# Altium project Display_Control_UV.PrjPcb
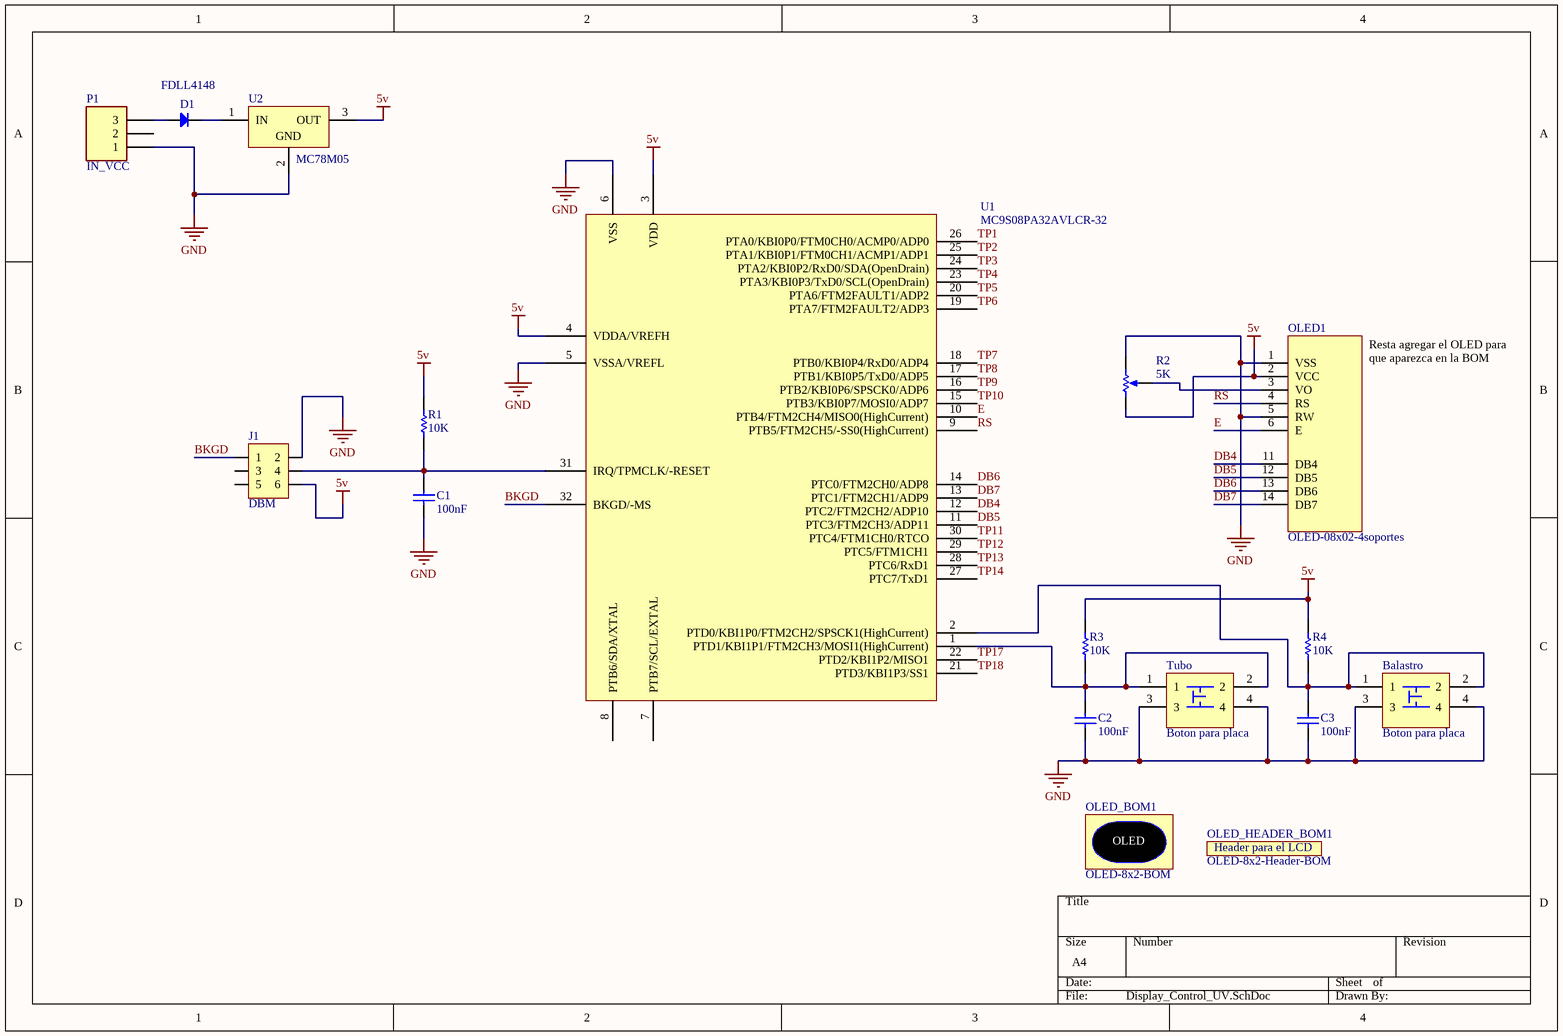
[diagram p0: Display_Control_UV.SchDoc]
1 sheet, 17 parts. Net scope: global (net labels, ports and power ports of the same name join across sheets).
Board file: Display_Control_UV.PcbDoc

## Sheet Display_Control_UV.SchDoc
size A4

### Parts
Balastro  Boton para placa  [TactButton]
C1  100nF  [C_0603]
C2  100nF  [C_0603]
C3  100nF  [C_0603]
D1  FDLL4148  [SOD-80/MLL34]
J1  DBM  [DBM]
OLED1  OLED-08x02-4soportes  [OLED-ZocaloDoble]
OLED_BOM1  OLED-8x2-BOM  [OLED-08x02-4soportes]
OLED_HEADER_BOM1  OLED-8x2-Header-BOM
P1  IN_VCC  [B3B-XH-A_3D]
R1  10K  [R_0603]
R2  5K  [Preset_SMD]
R3  10K  [R_0603]
R4  10K  [R_0603]
Tubo  Boton para placa  [TactButton]
U1  MC9S08PA32AVLCR-32  [QFP7x7]
U2  MC78M05  [TO-252AA_N]

### Nets
5v: J1.6 OLED1.2(VCC) R1.2 R2.1(TOP_CCW) R3.2 R4.2 U1.3(VDD) U1.4(VDDA/VREFH) U2.3(OUT)
GND: Balastro.3 Balastro.4 C1.1 C2.1 C3.1 J1.2 OLED1.1(VSS) OLED1.5(RW) P1.1 R2.3(BOT_CW) Tubo.3 Tubo.4 U1.5(VSSA/VREFL) U1.6(VSS) U2.2(GND)
BKGD: J1.1 U1.32(BKGD/-MS)
DB4: OLED1.11(DB4) U1.12(PTC2/FTM2CH2/ADP10)
DB5: OLED1.12(DB5) U1.11(PTC3/FTM2CH3/ADP11)
DB6: OLED1.13(DB6) U1.14(PTC0/FTM2CH0/ADP8)
DB7: OLED1.14(DB7) U1.13(PTC1/FTM2CH1/ADP9)
E: OLED1.6(E) U1.10(PTB4/FTM2CH4/MISO0(HighCurrent))
RS: OLED1.4(RS) U1.9(PTB5/FTM2CH5/-SS0(HighCurrent))
TP1: U1.26(PTA0/KBI0P0/FTM0CH0/ACMP0/ADP0)
TP2: U1.25(PTA1/KBI0P1/FTM0CH1/ACMP1/ADP1)
TP3: U1.24(PTA2/KBI0P2/RxD0/SDA(OpenDrain))
TP4: U1.23(PTA3/KBI0P3/TxD0/SCL(OpenDrain))
TP5: U1.20(PTA6/FTM2FAULT1/ADP2)
TP6: U1.19(PTA7/FTM2FAULT2/ADP3)
TP7: U1.18(PTB0/KBI0P4/RxD0/ADP4)
TP8: U1.17(PTB1/KBI0P5/TxD0/ADP5)
TP9: U1.16(PTB2/KBI0P6/SPSCK0/ADP6)
TP10: U1.15(PTB3/KBI0P7/MOSI0/ADP7)
TP11: U1.30(PTC4/FTM1CH0/RTCO)
TP12: U1.29(PTC5/FTM1CH1)
TP13: U1.28(PTC6/RxD1)
TP14: U1.27(PTC7/TxD1)
TP17: U1.22(PTD2/KBI1P2/MISO1)
TP18: U1.21(PTD3/KBI1P3/SS1)
NetBalastro_1: Balastro.1 Balastro.2 C3.2 R4.1 U1.2(PTD0/KBI1P0/FTM2CH2/SPSCK1(HighCurrent))
NetC1_2: C1.2 J1.4 R1.1 U1.31(IRQ/TPMCLK/-RESET)
NetC2_2: C2.2 R3.1 Tubo.1 Tubo.2 U1.1(PTD1/KBI1P1/FTM2CH3/MOSI1(HighCurrent))
NetD1_1: D1.1(A) P1.3
NetD1_2: D1.2(K) U2.1(IN)
NetOLED1_3: OLED1.3(VO) R2.2(TAP)

Not connected (* = marked no-connect by the designer): J1 3 5; P1 2; U1 7(PTB7/SCL/EXTAL) 8(PTB6/SDA/XTAL)

### Notes on the sheet
- (in symbol OLED-08x02-4soportes) Resta agregar el OLED para que aparezca en la BOM
- (in symbol OLED-8x2-BOM) OLED
- (in symbol OLED-8x2-Header-BOM) Header para el LCD

### Library data of the parts
Balastro Tubo = TactButton: Ejemplo; Cod.Fabricante: 1825910-6; Fabricante: TE Connectivity ALCOSWITCH Switches; Cod.DigiKey: 450-1650-ND; ComponentLink1Description: Manufacturer Link; ComponentLink1URL: https://www.te.com/commerce/DocumentDelivery/DDEController?Action=srchrtrv&DocNm=1825910&DocType=Customer+Drawing&DocLang=English; ComponentLink2Description: Datasheet; ComponentLink2URL: https://www.te.com/commerce/DocumentDelivery/DDEController?Action=srchrtrv&DocNm=1825910&DocType=Customer+Drawing&DocLang=English; DatasheetVersion: *; DIGIKEYx100: 0.08700; LatestRevisionDate: *; LatestRevisionNote: *; PackageDescription: *; PackageReference: *; PackageVersion: *; Published: 29-sep-00; Publisher: Altium Limited; Value: *
C1-C3 = C_100nF_0603: CAP CER 0.1UF 50V X7R 0603; Note: Footprint corresponds to dimensions for bulk cassette packaging. This case size has tightened tolerances.; Cod.Fabricante: C0603C104M5RACTU; Fabricante: KEMET; Published: 17-Jul-2002; LatestRevisionDate: 19-Mar-2004; LatestRevisionNote: Silkscreen size reduced.; DatasheetDocument: Mar-2001; PackageDocument: Mar-2001; PackageReference: 0603; Publisher: Altium Limited; ComponentLink1Description: Manufacturer Link; ComponentLink1URL: http://www.kemet.com/; ComponentLink2Description: Datasheet; ComponentLink2URL: https://api.kemet.com/component-edge/download/datasheet/C0603C104M5RACTU.pdf; Cod.Digikey: 399-7845-1-ND; Value: 100nF; DIGIKEYx100: 0.01740
D1 = Diode FDLL4148: DIODE GEN PURP 100V 200MA LL34/SOD80/MINI MELF; Fabricante: ON Semiconductor; Published: 8-Jun-2000; LatestRevisionDate: 17-Jul-2002; LatestRevisionNote: Re-released for DXP Platform.; DatasheetDocument: 1998; PackageDocument: Aug-1999; PackageReference: MINI MELF; Publisher: Altium Limited; Code_JEDEC: MINI MELF; ComponentLink1Description: Manufacturer Link; ComponentLink1URL: https://www.fairchildsemi.com; ComponentLink2Description: Datasheet; ComponentLink2URL: https://www.fairchildsemi.com/datasheets/FD/FDLL4148.pdf; Value: FDLL4148; Cod.Digikey: FDLL4148CT-ND; Cod.Fabricante: FDLL4148; DIGIKEYx100: 0.0487
J1 = DBM: CONN HEADER VERT 6POS 2.54MM; Cod.Fabricante: PRPC003DAAN-RC; Fabricante: Sullins Connector Solutions; Cod.DigiKey: S2011EC-03-ND; ComponentLink1Description: Manufacturer Link; ComponentLink1URL: https://drawings-pdf.s3.amazonaws.com/11636.pdf; ComponentLink2Description: Datasheet; ComponentLink2URL: *; DatasheetVersion: *; DIGIKEYx100: 0.12070; LatestRevisionDate: *; LatestRevisionNote: *; PackageDescription: *; PackageReference: *; PackageVersion: *; Published: 29-sep-00; Publisher: Altium Limited; Value: *
OLED1 = OLED-08x02-4soportes: Header para la placa 8x2 OLED Character Display; Cod.Fabricante: PRPC008DAAN-RC; Fabricante: Sullins Connector Solutions; Cod.DigiKey: S2011EC-08-ND; ComponentLink1Description: Manufacturer Link; ComponentLink1URL: https://drawings-pdf.s3.amazonaws.com/11636.pdf; ComponentLink2Description: Datasheet; ComponentLink2URL: https://drawings-pdf.s3.amazonaws.com/11636.pdf; DatasheetVersion: F; DIGIKEYx100: 0.30340; LatestRevisionDate: *; LatestRevisionNote: *; PackageDescription: *; PackageReference: *; PackageVersion: *; Published: 29-sep-00; Publisher: Altium Limited; Value: *
OLED_BOM1 = OLED-8x2-BOM: 8x2 OLED Character Display; Cod.Fabricante: WEH000802A-BPP5N0; Fabricante: Winstar; Cod.DigiKey: -; ComponentLink1Description: Manufacturer Link; ComponentLink1URL: http://www.sycelectronica.com.ar/optoelectronica/WH0802A-XXX-XX.pdf; ComponentLink2Description: Datasheet; ComponentLink2URL: *; DatasheetVersion: *; DIGIKEYx100: -; LatestRevisionDate: *; LatestRevisionNote: *; PackageDescription: *; PackageReference: *; PackageVersion: *; Published: 29-sep-00; Publisher: Altium Limited; Value: *
OLED_HEADER_BOM1 = OLED-8x2-Header-BOM: Header 8x2; Cod.Fabricante: PPPC082LFBN-RC; Fabricante: Sullins Connector Solutions; Cod.DigiKey: S7111-ND; ComponentLink1Description: Manufacturer Link; ComponentLink1URL: https://media.digikey.com/pdf/Data%20Sheets/Sullins%20PDFs/Female_Headers.100_DS.pdf; ComponentLink2Description: Datasheet; ComponentLink2URL: *; DatasheetVersion: *; DIGIKEYx100: 0.78010; LatestRevisionDate: *; LatestRevisionNote: *; PackageDescription: *; PackageReference: *; PackageVersion: *; Published: 29-sep-00; Publisher: Altium Limited; Value: *
P1 = JST_2.5_3: CONN HEADER XH TOP 3POS 2.5MM; Cod.Fabricante: B3B-XH-A(LF)(SN); Fabricante: JST Sales America Inc.; LatestRevisionDate: 17-Jul-2002; LatestRevisionNote: Re-released for DXP Platform.; Publisher: Altium Limited; Cod.Digikey: 455-2248-ND; ComponentLink2Description: Datasheet; ComponentLink2URL: http://www.jst-mfg.com/product/pdf/eng/eXH.pdf; DIGIKEYx100: 0.1115
R1 R3 R4 = R_10k_0603: RES SMD 10K OHM 5% 1/10W 0603; Cod.Fabricante: RC0603JR-0710KL; Fabricante: Yageo; Published: 8-Jun-2000; LatestRevisionDate: 17-Jul-2002; LatestRevisionNote: Re-released for DXP Platform.; PackageReference: 0603; Publisher: Altium Limited; Cod.Digikey: 311-10KGRCT-ND; Value: 10K; DIGIKEYx100: 0.00770
R2 = Preset_5k_SMD: TRIMMER 5K OHM 0.5W GW TOP ADJ; Cod.Fabricante: 3361P-1-502GLF; Fabricante: Bourns Inc.; Published: 8-Jun-2000; LatestRevisionDate: 17-Jul-2002; LatestRevisionNote: Re-released for DXP Platform.; PackageReference: VR5; Publisher: Altium Limited; PackageDescription: Variable Resistor, Thru-Hole; 3 Leads; Series: 3361P; Cod.Digikey: 3361P-502GLFCT-ND; DIGIKEYx100: 1.01750; Value: 5K
U1 = MC9S08PA32AVLCR-32: S08 Microcontroller IC 8-Bit 20MHz 32KB (32K x 8) FLASH 32-LQFP (7x7); Fabricante: NXP; Cod.Digikey: 568-15175-1-ND; Cod.Fabricante: MC9S08PA32AVLCR; ComponentLink1Description: Manufacturer Link; ComponentLink1URL: https://www.nxp.com/docs/en/data-sheet/MC9S08PA60_Rev1.pdf; ComponentLink2Description: Datasheet; ComponentLink2URL: https://www.nxp.com/docs/en/data-sheet/MC9S08PA60_Rev1.pdf; DatasheetVersion: Rev. 2; DIGIKEYx100: 1.75940; LatestRevisionDate: 8/2014; LatestRevisionNote: *; PackageDescription: *; PackageReference: *; PackageVersion: 32-LQFP; Published: *; Publisher: *; Value: MC9S08PA32AVLCR-32
U2 = MC78M05: IC REG LINEAR 5V 500MA DPAK; Cod.Fabricante: MC78M05BDTRKG; Fabricante: ON Semiconductor; Published: 24-Aug-2001; LatestRevisionDate: 17-Jul-2002; LatestRevisionNote: Re-released for DXP Platform.; DatasheetVersion: Nov-1999; PackageReference: DPAK; Publisher: Altium Limited; PackageDescription: DPak (2 Leads + Tab); ComponentLink1Description: Manufacturer Link; ComponentLink1URL: http://www.onsemi.com; ComponentLink2Description: Datasheet; ComponentLink2URL: http://www.onsemi.com/pub/Collateral/MC78M00-D.PDF; Cod.Digikey: MC78M05BDTRKGOSCT-ND; DIGIKEYx100: 0.27660